# Altium project SUBBOARD-sensors.PrjPcb
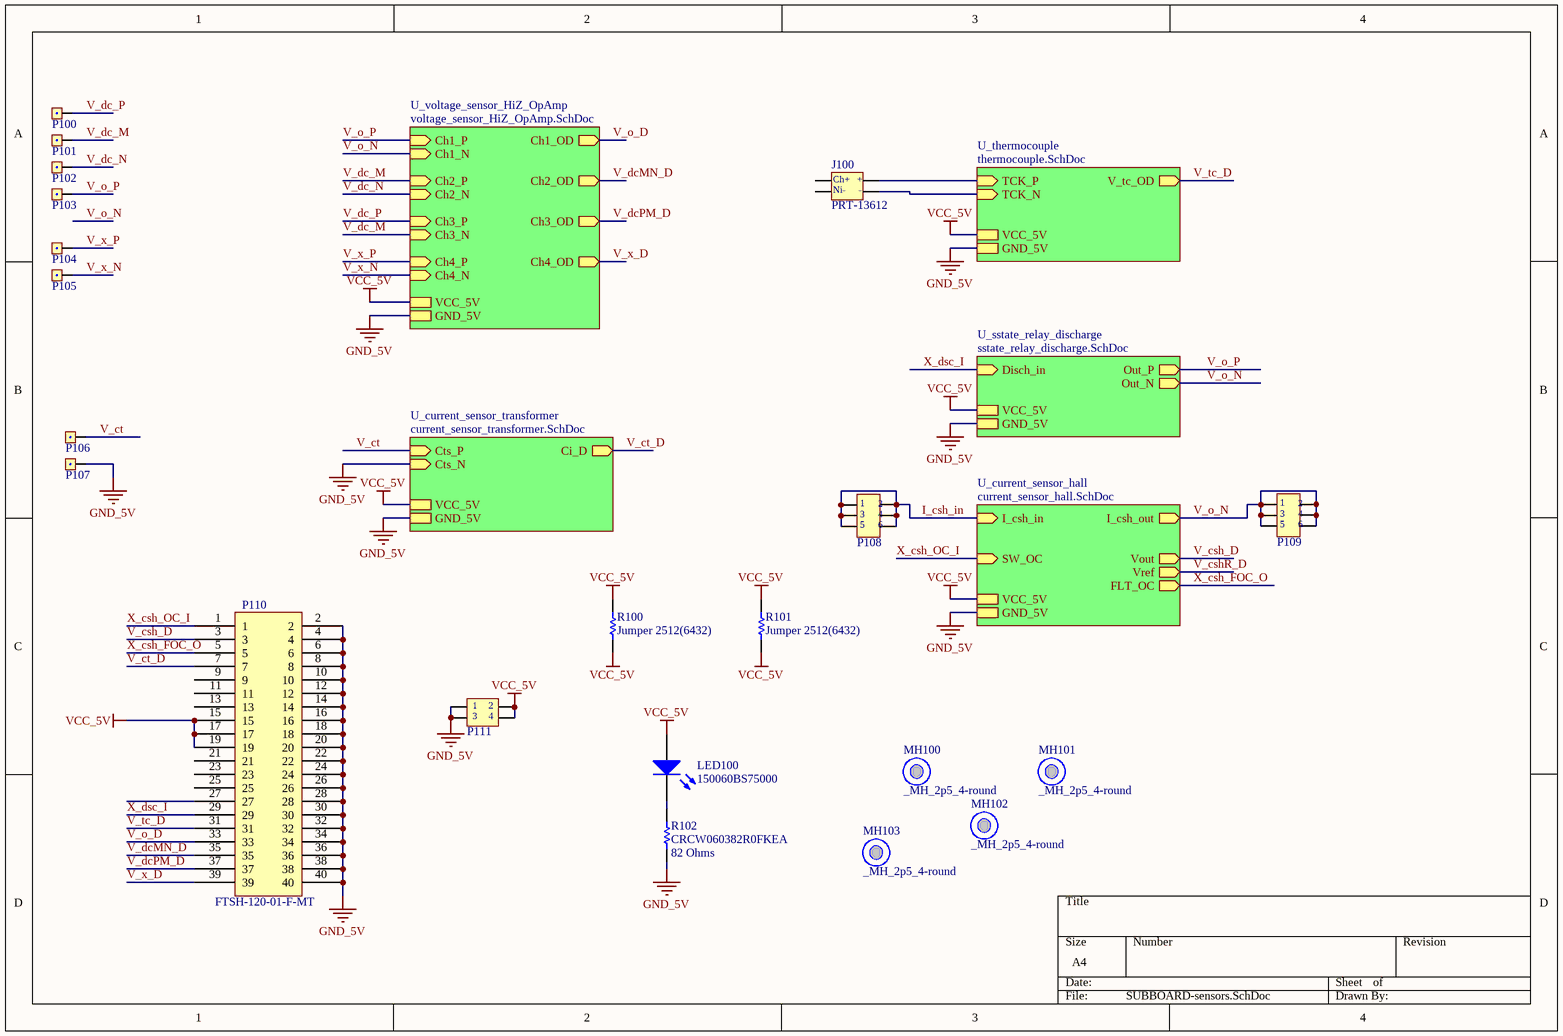
[diagram p0: SUBBOARD-sensors.SchDoc]
6 sheets, 142 parts. Net scope: hierarchical (ports join the sheet entries above them; power ports are global).
Board file: SUBBOARD-sensors.PcbDoc
Sheets:
  SUBBOARD-sensors.SchDoc
    U_voltage_sensor_HiZ_OpAmp = voltage_sensor_HiZ_OpAmp.SchDoc
    U_current_sensor_hall = current_sensor_hall.SchDoc
    U_current_sensor_transformer = current_sensor_transformer.SchDoc
    U_thermocouple = thermocouple.SchDoc
    U_sstate_relay_discharge = sstate_relay_discharge.SchDoc

## Sheet SUBBOARD-sensors.SchDoc
size A4

### Parts
J100  PRT-13612  [PRT-13612]
LED100  150060BS75000  [0603_A]
MH100  _MH_2p5_4-round  [_MH_2p5_4-round]
MH101  _MH_2p5_4-round  [_MH_2p5_4-round]
MH102  _MH_2p5_4-round  [_MH_2p5_4-round]
MH103  _MH_2p5_4-round  [_MH_2p5_4-round]
P100  TSW-101-15-G-S  [TSW-101-15-G-S]  (value not drawn)
P101  TSW-101-15-G-S  [TSW-101-15-G-S]  (value not drawn)
P102  TSW-101-15-G-S  [TSW-101-15-G-S]  (value not drawn)
P103  TSW-101-15-G-S  [TSW-101-15-G-S]  (value not drawn)
P104  TSW-101-15-G-S  [TSW-101-15-G-S]  (value not drawn)
P105  TSW-101-15-G-S  [TSW-101-15-G-S]  (value not drawn)
P106  TSW-101-15-G-S  [TSW-101-15-G-S]  (value not drawn)
P107  TSW-101-15-G-S  [TSW-101-15-G-S]  (value not drawn)
P108  TSW-103-15-G-D  [TSW-103-15-G-D]  (value not drawn)
P109  TSW-103-15-G-D  [TSW-103-15-G-D]  (value not drawn)
P110  FTSH-120-01-F-MT  [FTSH-120-01-F-MT]
P111  TMM-102-02-T-D  [TMM-102-02-T-D]  (value not drawn)
R100  Jumper 2512(6432)  [RESC2512(6432)_L]
R101  Jumper 2512(6432)  [RESC2512(6432)_L]
R102  CRCW060382R0FKEA  value 82 Ohms  [RESC1609X50X30LL10T20]

### Sub-sheets
U_current_sensor_hall = current_sensor_hall.SchDoc: I_csh_in (in), I_csh_out (out), VCC_5V, GND_5V, Vout (out), Vref (out), FLT_OC (out), SW_OC (in)
U_current_sensor_transformer = current_sensor_transformer.SchDoc: VCC_5V, GND_5V, Cts_P (in), Cts_N (in), Ci_D (out)
U_sstate_relay_discharge = sstate_relay_discharge.SchDoc: VCC_5V, GND_5V, Disch_in (in), Out_P (out), Out_N (out)
U_thermocouple = thermocouple.SchDoc: V_tc_OD (out), VCC_5V, GND_5V, TCK_P (in), TCK_N (in)
U_voltage_sensor_HiZ_OpAmp = voltage_sensor_HiZ_OpAmp.SchDoc: VCC_5V, GND_5V, Ch1_OD (out), Ch2_OD (out), Ch3_OD (out), Ch4_OD (out), Ch1_N (in), Ch1_P (in), Ch2_N (in), Ch2_P (in), Ch3_N (in), Ch3_P (in), Ch4_N (in), Ch4_P (in)

### Nets
GND_5V: P107.1 P110.2 P110.4 P110.6 P110.8 P110.10 P110.12 P110.14 P110.16 P110.18 P110.20 P110.22 P110.24 P110.26 P110.28 P110.30 P110.32 P110.34 P110.36 P110.38 P110.40 P111.1 P111.3 R102.2 ; sheet U_voltage_sensor_HiZ_OpAmp/GND_5V, sheet U_current_sensor_hall/GND_5V, sheet U_current_sensor_transformer/GND_5V, sheet U_current_sensor_transformer/Cts_N, sheet U_thermocouple/GND_5V, sheet U_sstate_relay_discharge/GND_5V
VCC_5V: LED100.2(A) P110.15 P110.17 P110.19 P111.2 P111.4 R100.1 R100.2 R101.1 R101.2 ; sheet U_voltage_sensor_HiZ_OpAmp/VCC_5V, sheet U_current_sensor_hall/VCC_5V, sheet U_current_sensor_transformer/VCC_5V, sheet U_thermocouple/VCC_5V, sheet U_sstate_relay_discharge/VCC_5V
I_csh_in: P108.1 P108.2 P108.3 P108.4 P108.5 P108.6 ; sheet U_current_sensor_hall/I_csh_in
TCK_N: J100.4 ; sheet U_thermocouple/TCK_N
TCK_P: J100.3 ; sheet U_thermocouple/TCK_P
V_csh_D: P110.3 ; sheet U_current_sensor_hall/Vout
V_ct: P106.1 ; sheet U_current_sensor_transformer/Cts_P  [project net Ct_2]
V_ct_D: P110.7 ; sheet U_current_sensor_transformer/Ci_D
V_dc_M: P101.1 ; sheet U_voltage_sensor_HiZ_OpAmp/Ch2_P, sheet U_voltage_sensor_HiZ_OpAmp/Ch3_N
V_dc_N: P102.1 ; sheet U_voltage_sensor_HiZ_OpAmp/Ch2_N
V_dc_P: P100.1 ; sheet U_voltage_sensor_HiZ_OpAmp/Ch3_P
V_dcMN_D: P110.35 ; sheet U_voltage_sensor_HiZ_OpAmp/Ch2_OD
V_dcPM_D: P110.37 ; sheet U_voltage_sensor_HiZ_OpAmp/Ch3_OD
V_o_D: P110.33 ; sheet U_voltage_sensor_HiZ_OpAmp/Ch1_OD
V_o_N: P109.1 P109.2 P109.3 P109.4 P109.5 P109.6 ; sheet U_voltage_sensor_HiZ_OpAmp/Ch1_N, sheet U_current_sensor_hall/I_csh_out, sheet U_sstate_relay_discharge/Out_N
V_o_P: P103.1 ; sheet U_voltage_sensor_HiZ_OpAmp/Ch1_P, sheet U_sstate_relay_discharge/Out_P
V_tc_D: P110.31 ; sheet U_thermocouple/V_tc_OD
V_x_D: P110.39 ; sheet U_voltage_sensor_HiZ_OpAmp/Ch4_OD
V_x_N: P105.1 ; sheet U_voltage_sensor_HiZ_OpAmp/Ch4_N
V_x_P: P104.1 ; sheet U_voltage_sensor_HiZ_OpAmp/Ch4_P
X_csh_FOC_O: P110.5 ; sheet U_current_sensor_hall/FLT_OC
X_csh_OC_I: P110.1 ; sheet U_current_sensor_hall/SW_OC
X_dsc_I: P110.29 ; sheet U_sstate_relay_discharge/Disch_in
NetLED100_1: LED100.1(K) R102.1

Not connected (* = marked no-connect by the designer): J100 1 2; P110 9 11 13 21 23 25 27

### Notes on the sheet
- (in symbol PRT-13612) Ch+; +; Ni-; -

### Library data of the parts
J100 = PRT-13612: THERMOCOUPLE CONN - PCC-SMP-K; Manufacturer: SparkFun; System: Connector; Supplier 1: Digi-Key; Manufacturer Part Number: PRT-13612; RoHS: No; Stock 1: 201; Pricing 1: 1=4.38000 (USD); ComponentLink1URL: https://cdn.sparkfun.com/datasheets/Prototyping/PCC-SMP-K-datasheet.pdf?src-supplier=Digi-Key; ComponentLink1Description: https://cdn.sparkfun.com/datasheets/Prototyping/PCC-SMP-K-datasheet.pdf?src-supplier=Digi-Key; Supplier Part Number 1: 1568-1306-ND
LED100 = CMP-1426-00003-1: SMD mono-color Chip LED, WL-SMCW, Blue; Manufacturer: Wuerth Elektronik; Color: Blue; ComponentLink2Description: Datasheet; ComponentLink2URL: http://katalog.we-online.com/led/datasheet/150060BS75000.pdf; ComponentLink1URL: http://www.we-online.com; PackageReference: 0603_A; PartNumber: 150060BS75000; ComponentLink1Description: Manufacturer URL
MH100-MH103 = _MH_2p5_4-round: matching hole 2.5 hole, 4mm pad (round)
P100-P107 = TSW-101-15-G-S: Conn Unshrouded Header HDR 1 POS Solder ST Thru-Hole; Manufacturer: Samtec; Gender: Male; Max Current Rating: 7.6A; Max Voltage Rating (AC): 550V; Number of Contacts: 1; System: Connector; Supplier 1: Digi-Key; Manufacturer Part Number: TSW-101-15-G-S; RoHS: Yes; Category: Connectors; Stock 1: 1116; Pricing 1: 1=0.16000 (USD); Mount: Through Hole; Housing Material: Polyester; Housing Color: Black; Contact Material: Bronze; Contact Plating: Gold; Min Operating Temperature: -55°C; Max Operating Temperature: 125°C; Orientation: Straight; Number of Rows: 1; Packaging: Bulk; Termination: Solder; Length: 2.54mm; Depth: 2.54mm; Radiation Hardening: No; REACH SVHC: No SVHC; ComponentLink1URL: https://datasheet.ciiva.com/16736/htsw-th-16736491.pdf?src-supplier=Avnet+Europe; ComponentLink1Description: https://datasheet.ciiva.com/16736/htsw-th-16736491.pdf?src-supplier=Avnet+Europe; ComponentLink2URL: https://datasheet.ciiva.com/10337/htsw-th-10337087.pdf?src-supplier=Avnet; ComponentLink2Description: https://datasheet.ciiva.com/10337/htsw-th-10337087.pdf?src-supplier=Avnet; Supplier Part Number 1: TSW-101-15-G-S-ND
P108 P109 = TSW-103-15-G-D: .025" SQ. TERMINAL STRIPS; Manufacturer: Samtec; Number of Contacts: 6; Gender: Male; Max Voltage Rating (AC): 550V; Max Current Rating: 7.6A; Pitch: 2.54mm; System: Connector; Supplier 1: Digi-Key; Manufacturer Part Number: TSW-103-15-G-D; RoHS: Yes; Category: Headers and Wire Housings; Stock 1: 480; Pricing 1: 1=0.78000, 10=0.73200, 100=0.56120, 500=0.48800, 1000=0.40260, 5000=0.35380, 10000=0.32940 (USD); Contact Plating: Gold; Contact Material: Bronze; Housing Material: Polyester; Housing Color: Black; Min Operating Temperature: -55°C; Max Operating Temperature: 125°C; Termination: Solder; Number of Rows: 2; Packaging: Bulk; Orientation: Straight; Length: 7.62mm; Row Spacing: 2.54mm; Depth: 5.08mm; Radiation Hardening: No; REACH SVHC: No SVHC; ComponentLink1URL: https://datasheet.ciiva.com/16723/htsw-th-16723063.pdf?src-supplier=Avnet+Europe; ComponentLink1Description: https://datasheet.ciiva.com/16723/htsw-th-16723063.pdf?src-supplier=Avnet+Europe; ComponentLink2URL: https://datasheet.ciiva.com/29947/htsw-th-29947802.pdf?src-supplier=Avnet; ComponentLink2Description: https://datasheet.ciiva.com/29947/htsw-th-29947802.pdf?src-supplier=Avnet; Supplier Part Number 1: SAM12306-ND
P110 = FTSH-120-01-F-MT: Conn Unshrouded Header HDR 40 POS 1.27mm Solder RA Thru-Hole/SMD Tube; Manufacturer: Samtec; Number of Contacts: 40; Gender: Male; System: Connector; Supplier 1: Digi-Key; Manufacturer Part Number: FTSH-120-01-F-MT; RoHS: Yes; Category: Headers and Wire Housings; Stock 1: 47; Pricing 1: 1=5.48000 (USD); Contact Plating: Gold; Contact Material: Bronze; Housing Material: Polymer; Housing Color: Black; Min Operating Temperature: -55°C; Max Operating Temperature: 125°C; Number of Rows: 2; Termination: Solder; Packaging: Rail/Tube; Orientation: Right Angle; Length: 25.4mm; Pitch: 1.27mm; Depth: 10.64mm; Radiation Hardening: No; Lead Free: Lead Free; ComponentLink1URL: https://datasheet.ciiva.com/16697/ftsh-mt-16697612.pdf?src-supplier=Avnet+Europe; ComponentLink1Description: https://datasheet.ciiva.com/16697/ftsh-mt-16697612.pdf?src-supplier=Avnet+Europe; Supplier Part Number 1: FTSH-120-01-F-MT-ND; Supplier 2: Avnet; Pricing 2: 1=5.23577, 10=4.92660, 30=4.79780, 50=4.57240, 100=4.37920 (USD); Supplier 3: Newark; Pricing 3: 1=5.48000, 10=5.04000, 25=4.62000, 50=4.43000, 100=4.21000, 250=3.68000, 500=3.57000 (USD); Supplier Part Number 2: FTSH-120-01-F-MT; Supplier Part Number 3: 01R7043
P111 = TMM-102-02-T-D: SAMTEC         TMM-102-02-T-D             Board-To-Board Connector, TMM Series, 4 Contacts, Header, 2 mm, Through Hole, 2 Rows; Gender: Male; Number of Contacts: 4; Pitch: 2mm; Supplier 1: Digi-Key; Manufacturer: Samtec; Manufacturer Part Number: TMM-102-02-T-D; RoHS: Yes; Category: Connectors; Stock 1: 996; Pricing 1: 1=0.36000 (USD); Mount: Through Hole; Contact Plating: Tin; Contact Material: Bronze; Packaging: Bulk; Number of Rows: 2; Termination: Solder; Radiation Hardening: No; Lead Free: Lead Free; REACH SVHC: No SVHC; ComponentLink1URL: http://www.farnell.com/datasheets/2047777.pdf?src-supplier=Farnell; ComponentLink1Description: http://www.farnell.com/datasheets/2047777.pdf?src-supplier=Farnell; ComponentLink2URL: ftp://ftp.samtec.com/webfiles/PDF/TMM_TH.PDF?src-supplier=Avnet; ComponentLink2Description: ftp://ftp.samtec.com/webfiles/PDF/TMM_TH.PDF?src-supplier=Avnet; Supplier Part Number 1: TMM-102-02-T-D-ND; System: Connector
R100 R101 = CMP-1018-00001-1: Jumper 2512 (6432 Metric); Tolerance: None; Case-EIA: 2512; Value: 0.00 Ohm; Case-Metric: 6432; Technology: SMT; Power: None
R102 = CMP-2000-03606-1: Manufacturer: Vishay Dale; Part Number: CRCW060382R0FKEA

## Sheet voltage_sensor_HiZ_OpAmp.SchDoc
size A3
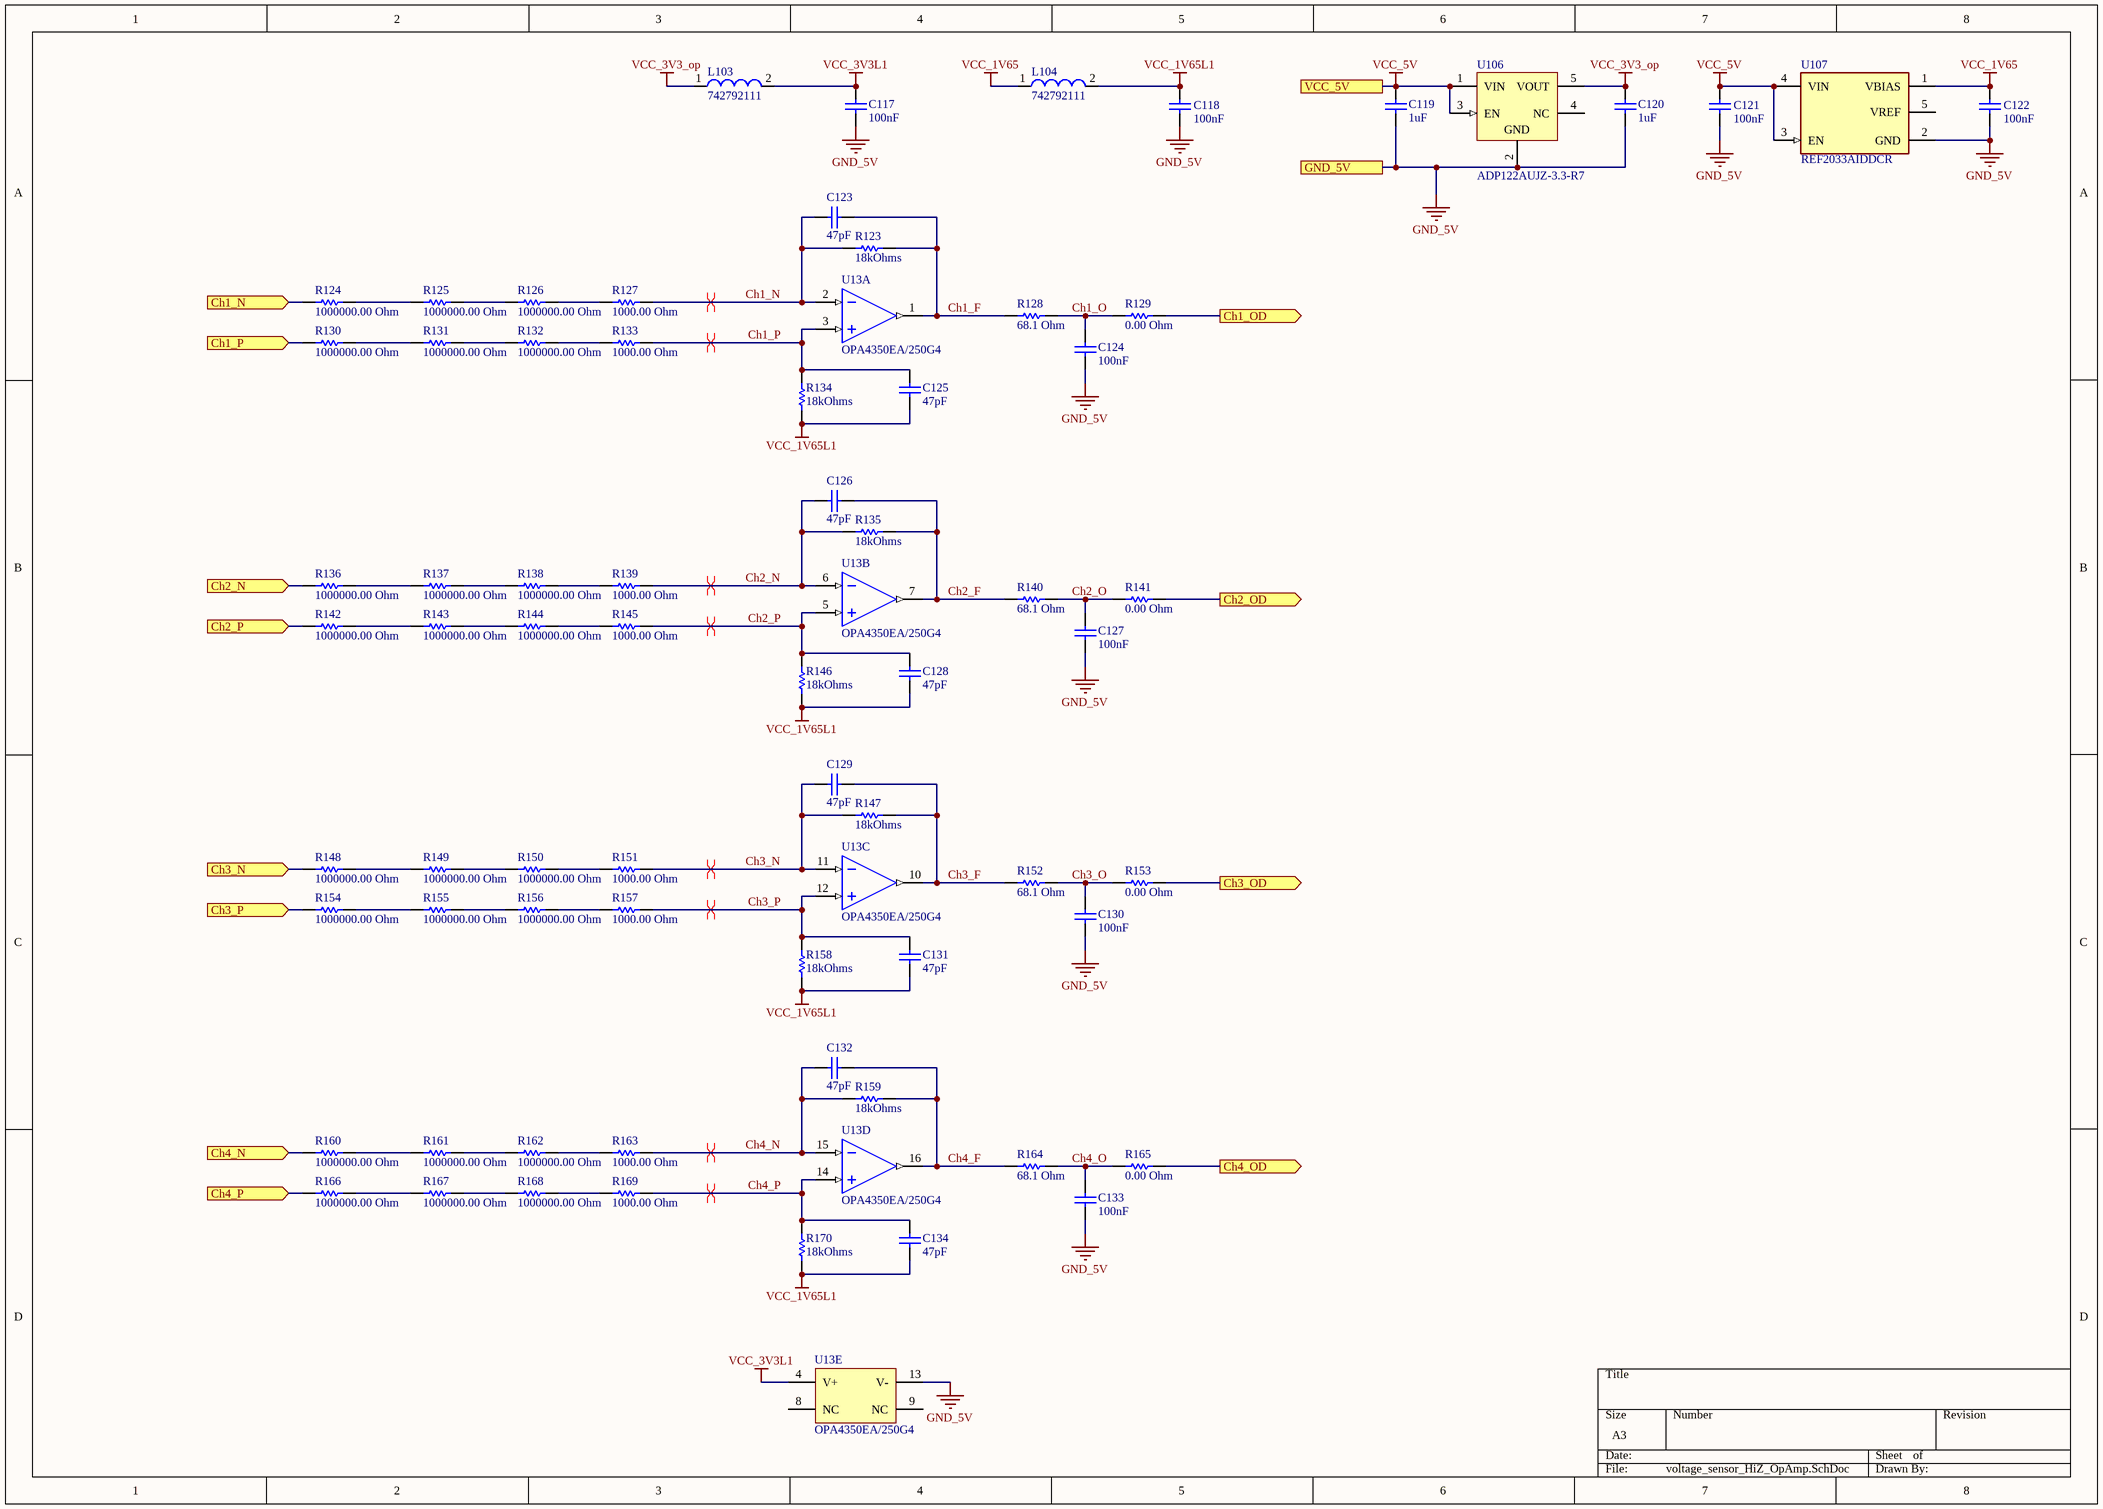
[diagram p1: voltage_sensor_HiZ_OpAmp.SchDoc]

### Parts
C117  value 100nF  [CAPC0603(1608)100_N]  (hidden comment: CAP 100nF 10V 0603(1608))
C118  value 100nF  [CAPC0603(1608)100_N]  (hidden comment: CAP 100nF 10V 0603(1608))
C119  value 1uF  [CAPC0603(1608)100_N]  (hidden comment: CAP 1uF 50V 0603(1608))
C120  value 1uF  [CAPC0603(1608)100_N]  (hidden comment: CAP 1uF 50V 0603(1608))
C121  value 100nF  [CAPC0603(1608)100_N]  (hidden comment: CAP 100nF 10V 0603(1608))
C122  value 100nF  [CAPC0603(1608)100_N]  (hidden comment: CAP 100nF 10V 0603(1608))
C123  value 47pF  [CAPC0603(1608)100_L]  (hidden comment: CAP 47pF 50V 0603(1608))
C124  value 100nF  [CAPC0603(1608)100_L]  (hidden comment: CAP 100nF 10V 0603(1608))
C125  value 47pF  [CAPC0603(1608)100_L]  (hidden comment: CAP 47pF 50V 0603(1608))
C126  value 47pF  [CAPC0603(1608)100_L]  (hidden comment: CAP 47pF 50V 0603(1608))
C127  value 100nF  [CAPC0603(1608)100_L]  (hidden comment: CAP 100nF 10V 0603(1608))
C128  value 47pF  [CAPC0603(1608)100_L]  (hidden comment: CAP 47pF 50V 0603(1608))
C129  value 47pF  [CAPC0603(1608)100_L]  (hidden comment: CAP 47pF 50V 0603(1608))
C130  value 100nF  [CAPC0603(1608)100_L]  (hidden comment: CAP 100nF 10V 0603(1608))
C131  value 47pF  [CAPC0603(1608)100_L]  (hidden comment: CAP 47pF 50V 0603(1608))
C132  value 47pF  [CAPC0603(1608)100_L]  (hidden comment: CAP 47pF 50V 0603(1608))
C133  value 100nF  [CAPC0603(1608)100_L]  (hidden comment: CAP 100nF 10V 0603(1608))
C134  value 47pF  [CAPC0603(1608)100_L]  (hidden comment: CAP 47pF 50V 0603(1608))
L103  742792111  [SMD-1206]
L104  742792111  [SMD-1206]
R123  Resistance: 18kOhms  [RESC1608X55X25NL10T15]  (hidden comment: RC0603FR-0718KL)
R124  value 1000000.00 Ohm  [RESC1206(3216)_L]  (hidden comment: 1M 1% 1206(3216))
R125  value 1000000.00 Ohm  [RESC1206(3216)_L]  (hidden comment: 1M 1% 1206(3216))
R126  value 1000000.00 Ohm  [RESC1206(3216)_L]  (hidden comment: 1M 1% 1206(3216))
R127  value 1000.00 Ohm  [RESC1206(3216)_L]  (hidden comment: 1K 1% 1206(3216))
R128  value 68.1 Ohm  [RESC1608X55X30LL15T15]  (hidden comment: ERJ-3EKF68R1V)
R129  value 0.00 Ohm  [RESC0603(1608)_L]  (hidden comment: Jumper 0603(1608))
R130  value 1000000.00 Ohm  [RESC1206(3216)_L]  (hidden comment: 1M 1% 1206(3216))
R131  value 1000000.00 Ohm  [RESC1206(3216)_L]  (hidden comment: 1M 1% 1206(3216))
R132  value 1000000.00 Ohm  [RESC1206(3216)_L]  (hidden comment: 1M 1% 1206(3216))
R133  value 1000.00 Ohm  [RESC1206(3216)_L]  (hidden comment: 1K 1% 1206(3216))
R134  Resistance: 18kOhms  [RESC1608X55X25NL10T15]  (hidden comment: RC0603FR-0718KL)
R135  Resistance: 18kOhms  [RESC1608X55X25NL10T15]  (hidden comment: RC0603FR-0718KL)
R136  value 1000000.00 Ohm  [RESC1206(3216)_L]  (hidden comment: 1M 1% 1206(3216))
R137  value 1000000.00 Ohm  [RESC1206(3216)_L]  (hidden comment: 1M 1% 1206(3216))
R138  value 1000000.00 Ohm  [RESC1206(3216)_L]  (hidden comment: 1M 1% 1206(3216))
R139  value 1000.00 Ohm  [RESC1206(3216)_L]  (hidden comment: 1K 1% 1206(3216))
R140  value 68.1 Ohm  [RESC1608X55X30LL15T15]  (hidden comment: ERJ-3EKF68R1V)
R141  value 0.00 Ohm  [RESC0603(1608)_L]  (hidden comment: Jumper 0603(1608))
R142  value 1000000.00 Ohm  [RESC1206(3216)_L]  (hidden comment: 1M 1% 1206(3216))
R143  value 1000000.00 Ohm  [RESC1206(3216)_L]  (hidden comment: 1M 1% 1206(3216))
R144  value 1000000.00 Ohm  [RESC1206(3216)_L]  (hidden comment: 1M 1% 1206(3216))
R145  value 1000.00 Ohm  [RESC1206(3216)_L]  (hidden comment: 1K 1% 1206(3216))
R146  Resistance: 18kOhms  [RESC1608X55X25NL10T15]  (hidden comment: RC0603FR-0718KL)
R147  Resistance: 18kOhms  [RESC1608X55X25NL10T15]  (hidden comment: RC0603FR-0718KL)
R148  value 1000000.00 Ohm  [RESC1206(3216)_L]  (hidden comment: 1M 1% 1206(3216))
R149  value 1000000.00 Ohm  [RESC1206(3216)_L]  (hidden comment: 1M 1% 1206(3216))
R150  value 1000000.00 Ohm  [RESC1206(3216)_L]  (hidden comment: 1M 1% 1206(3216))
R151  value 1000.00 Ohm  [RESC1206(3216)_L]  (hidden comment: 1K 1% 1206(3216))
R152  value 68.1 Ohm  [RESC1608X55X30LL15T15]  (hidden comment: ERJ-3EKF68R1V)
R153  value 0.00 Ohm  [RESC0603(1608)_L]  (hidden comment: Jumper 0603(1608))
R154  value 1000000.00 Ohm  [RESC1206(3216)_L]  (hidden comment: 1M 1% 1206(3216))
R155  value 1000000.00 Ohm  [RESC1206(3216)_L]  (hidden comment: 1M 1% 1206(3216))
R156  value 1000000.00 Ohm  [RESC1206(3216)_L]  (hidden comment: 1M 1% 1206(3216))
R157  value 1000.00 Ohm  [RESC1206(3216)_L]  (hidden comment: 1K 1% 1206(3216))
R158  Resistance: 18kOhms  [RESC1608X55X25NL10T15]  (hidden comment: RC0603FR-0718KL)
R159  Resistance: 18kOhms  [RESC1608X55X25NL10T15]  (hidden comment: RC0603FR-0718KL)
R160  value 1000000.00 Ohm  [RESC1206(3216)_L]  (hidden comment: 1M 1% 1206(3216))
R161  value 1000000.00 Ohm  [RESC1206(3216)_L]  (hidden comment: 1M 1% 1206(3216))
R162  value 1000000.00 Ohm  [RESC1206(3216)_L]  (hidden comment: 1M 1% 1206(3216))
R163  value 1000.00 Ohm  [RESC1206(3216)_L]  (hidden comment: 1K 1% 1206(3216))
R164  value 68.1 Ohm  [RESC1608X55X30LL15T15]  (hidden comment: ERJ-3EKF68R1V)
R165  value 0.00 Ohm  [RESC0603(1608)_L]  (hidden comment: Jumper 0603(1608))
R166  value 1000000.00 Ohm  [RESC1206(3216)_L]  (hidden comment: 1M 1% 1206(3216))
R167  value 1000000.00 Ohm  [RESC1206(3216)_L]  (hidden comment: 1M 1% 1206(3216))
R168  value 1000000.00 Ohm  [RESC1206(3216)_L]  (hidden comment: 1M 1% 1206(3216))
R169  value 1000.00 Ohm  [RESC1206(3216)_L]  (hidden comment: 1K 1% 1206(3216))
R170  Resistance: 18kOhms  [RESC1608X55X25NL10T15]  (hidden comment: RC0603FR-0718KL)
U13  OPA4350EA/250G4  [TI-DBQ16_L]  (parts A,B,C,D,E of 5)
U106  ADP122AUJZ-3.3-R7  [ADI-UJ-5_N]
U107  REF2033AIDDCR  [FP-DDC0005A-IPC_C]

### Ports
Ch1_N (in), Ch1_OD (out), Ch1_P (in), Ch2_N (in), Ch2_OD (out), Ch2_P (in), Ch3_N (in), Ch3_OD (out), Ch3_P (in), Ch4_N (in), Ch4_OD (out), Ch4_P (in), GND_5V, VCC_5V

### Nets
GND_5V: C117.1 C118.1 C119.1 C120.1 C121.1 C122.1 C124.1 C127.1 C130.1 C133.1 U13.13(V-) U106.2(GND) U107.2(GND) ; port GND_5V
VCC_1V65: C122.2 L104.1 U107.1(VBIAS)
VCC_1V65L1: C118.2 C125.2 C128.2 C131.2 C134.2 L104.2 R134.2 R146.2 R158.2 R170.2
VCC_3V3_op: C120.2 L103.1 U106.5(VOUT)
VCC_3V3L1: C117.2 L103.2 U13.4(V+)
VCC_5V: C119.2 C121.2 U106.1(VIN) U106.3(EN) U107.3(EN) U107.4(VIN) ; port VCC_5V
Ch1_F: C123.2 R123.1 R128.2 U13.1(OUT_A)
Ch1_N: C123.1 R123.2 R127.1 U13.2(IN_A-)
Ch1_O: C124.2 R128.1 R129.2
Ch1_P: C125.1 R133.1 R134.1 U13.3(IN_A+)
Ch2_F: C126.2 R135.1 R140.2 U13.7(OUT_B)
Ch2_N: C126.1 R135.2 R139.1 U13.6(IN_B-)
Ch2_O: C127.2 R140.1 R141.2
Ch2_P: C128.1 R145.1 R146.1 U13.5(IN_B+)
Ch3_F: C129.2 R147.1 R152.2 U13.10(OUT_C)
Ch3_N: C129.1 R147.2 R151.1 U13.11(IN_C-)
Ch3_O: C130.2 R152.1 R153.2
Ch3_P: C131.1 R157.1 R158.1 U13.12(IN_C+)
Ch4_F: C132.2 R159.1 R164.2 U13.16(OUT_D)
Ch4_N: C132.1 R159.2 R163.1 U13.15(IN_D-)
Ch4_O: C133.2 R164.1 R165.2
Ch4_P: C134.1 R169.1 R170.1 U13.14(IN_D+)
V_dc_M: R142.2 R148.2 ; port Ch2_P, port Ch3_N
V_dc_N: R136.2 ; port Ch2_N
V_dc_P: R154.2 ; port Ch3_P
V_dcMN_D: R141.1 ; port Ch2_OD
V_dcPM_D: R153.1 ; port Ch3_OD
V_o_D: R129.1 ; port Ch1_OD
V_o_N: R124.2 ; port Ch1_N
V_o_P: R130.2 ; port Ch1_P
V_x_D: R165.1 ; port Ch4_OD
V_x_N: R160.2 ; port Ch4_N
V_x_P: R166.2 ; port Ch4_P
NetR124_1: R124.1 R125.2
NetR125_1: R125.1 R126.2
NetR126_1: R126.1 R127.2
NetR130_1: R130.1 R131.2
NetR131_1: R131.1 R132.2
NetR132_1: R132.1 R133.2
NetR136_1: R136.1 R137.2
NetR137_1: R137.1 R138.2
NetR138_1: R138.1 R139.2
NetR142_1: R142.1 R143.2
NetR143_1: R143.1 R144.2
NetR144_1: R144.1 R145.2
NetR148_1: R148.1 R149.2
NetR149_1: R149.1 R150.2
NetR150_1: R150.1 R151.2
NetR154_1: R154.1 R155.2
NetR155_1: R155.1 R156.2
NetR156_1: R156.1 R157.2
NetR160_1: R160.1 R161.2
NetR161_1: R161.1 R162.2
NetR162_1: R162.1 R163.2
NetR166_1: R166.1 R167.2
NetR167_1: R167.1 R168.2
NetR168_1: R168.1 R169.2

Not connected (* = marked no-connect by the designer): U13 8(NC) 9(NC); U106 4(NC); U107 5(VREF)

### Layout directives
differential pair: Ch1_N, Ch1_P, Ch2_N, Ch2_P, Ch3_N, Ch3_P, Ch4_N, Ch4_P

### Library data of the parts
C117 C118 C121 C122 C124 C127 C130 C133 = CMP-1035-02580-1: CAP 100nF 10V ±10% 0603 (1608 Metric) Thickness 1mm SMD; Tolerance: Â±10%; Case-EIA: 0603; Case-Metric: 1608; Max Thickness: 1 mm; Rated Voltage: 10 V; Technology: SMT
C119 C120 = CMP-1035-02746-1: CAP 1uF 50V ±20% 0603 (1608 Metric) Thickness 1mm SMD; Tolerance: Â±20%; Case-EIA: 0603; Case-Metric: 1608; Technology: SMT; Max Thickness: 1 mm; Rated Voltage: 50 V
C123 C125 C126 C128 C129 C131 C132 C134 = CMP-1035-01063-1: CAP 47pF 50V ±5% 0603 (1608 Metric) Thickness 1mm SMD; Case-EIA: 0603; Tolerance: Â±5%; Case-Metric: 1608; Technology: SMT; Max Thickness: 1 mm; Rated Voltage: 50 V
L103 L104 = CMP-0220-00024-1: SMD EMI Suppression Ferrite Bead WE-CBF, Z = 26 Ohm; Impedance: 26 Ohm; ComponentLink2Description: Datasheet; PackageReference: SMD-1206; ComponentLink2URL: http://www.we-online.de/katalog/media/pdf/742792111.pdf; PackageVersion: 2007; DatasheetVersion: Dec-2005; PackageDescription: Chip Inductor, 2-Leads, Body 3.2 x 1.6 mm; ComponentLink1URL: http://www.we-online.com; ComponentLink1Description: Manufacturer Link
R123 R134 R135 R146 R147 R158 R159 R170 = CMP-2000-06930-1: Chip Resistor, 18 KOhm, +/- 1%, 0.1 W, -55 to 155 degC, 0603 (1608 Metric), RoHS, Tape and Reel; Manufacturer: Yageo; Voltage Rating: 75V; Temperature Coefficient: 100PPM/C; Unit Weight: 0.000071oz; Power Rating: 100mW; Datasheet URL: http://www.yageo.com/documents/recent/PYu-RC_Group_51_RoHS_L_7.pdf; Packaging: Reel; Series: RC; Datasheet Version: Rev. 7, 05/2017; Type: GeneralPurposeChipResistorSurfaceMount; Termination Style: SMD/SMT; Package Reference: 0603; Operating Temperature Range: -55Cto+155C; Mounting Technology: SurfaceMount; Tolerance: 1%; Height: 0.45mm; Length: 1.6mm; Case Code - mm: 1608; Product: ThickFilmResistorsGeneralPurpose; RoHS: True; Product Category: ThickFilmResistors; Case Code - in: 0603; Brand: Yageo; Manufacturer URL: http://www.yageo.com/; Width: 0.8mm; Package / Case: 0603(1608metric); Package Description: 2-Pin Surface Mount Device, Body 1.6 x 0.8 mm
R124-R126 R130-R132 R136-R138 R142-R144 R148-R150 R154-R156 R160-R162 R166-R168 = CMP-1014-00849-1: 1M 0.25W 1% 1206 (3216 Metric)  SMD; Case-EIA: 1206; Case-Metric: 3216; Tolerance: 1 %; Power: 0.25 W; Technology: SMT
R127 R133 R139 R145 R151 R157 R163 R169 = CMP-1014-00510-1: 1K 0.25W 1% 1206 (3216 Metric)  SMD; Case-Metric: 3216; Case-EIA: 1206; Power: 0.25 W; Tolerance: 1 %; Technology: SMT
R128 R140 R152 R164 = CMP-2000-00621-1: Manufacturer: Panasonic; Tolerance: 1%; Part Number: ERJ-3EKF68R1V; Package: 0603
R129 R141 R153 R165 = CMP-1012-00001-1: Jumper 0603 (1608 Metric); Case-Metric: 1608; Power: None; Case-EIA: 0603; Technology: SMT; Tolerance: None
U13 = CMP-0272-00834-2: High-Speed, Single-Supply, Rail-to-Rail Operational Amplifier MicroAmplifier(TM) Series, 2.7 to 5.5 V, -55 to 150 degC, 16-pin SOP (DBQ16), Green (RoHS & no Sb/Br); Manufacturer: Texas Instruments; Iq per channel(Max)(mA): 7.5; Slew Rate(Typ)(V/us): 22; Sub Family: Low Input Bias Current Amp (<=10pA), Low Offset Voltage Amplifier (<=500uV), Low Supply Voltage Amplifier (<=2.7V), Precision Amplifier; Vn at 1kHz(Typ)(nV/rtHz): 18; CMRR(Min)(dB): 66; Offset Drift(Typ)(uV/C): 4; Vio (25C)(Max)(mV): 0.5; Total Supply Voltage(Min)(+5V is 5, +/-5V is 10): 2.7; IIB(Max)(pA): 10; Total Supply Voltage(Max)(+5V is 5, +/-5V is 10): 5.5; Eco-Plan: Green (RoHS & no Sb/Br); PackageVersion: 4073301-2/H, 10/2008; ComponentLink1Description: Manufacturer URL; ComponentLink2Description: Datasheet; Mounting Technology: Surface Mount; ComponentLink3Description: Package Specification; PackageReference: DBQ16; PartNumber: OPA4350EA/250G4; ComponentLink2URL: http://www.ti.com/general/docs/lit/getliterature.tsp?genericPartNumber=OPA4350&fileType=pdf; ComponentLink1URL: http://www.ti.com/; Code_JEDEC: MO-137; DatasheetVersion: SBOS099C; Number of Channels: 4; ComponentLink3URL: http://www.ti.com/litv/pdf/msoi004g; PackageDescription: 16-Pin, Plastic Small Outline, Body 3.9 x 4.9 mm, Pitch 0.635 mm
U106 = CMP-0786-00346-1: 300 mA, Low Quiescent Current, CMOS Linear Regulator, 2.3 to 5.5 V Vin, 3.3 V Vout, Industrial, 5-pin SOT23 (UJ-5), Reel; Manufacturer: Analog Devices; Vin (min) (V): 2.3; Supply Current IGND @ Small Load: 45uA; Vin (max) (V): 5.5; Iout max: 300mA; Preset Vout Values (V): 3.3; ComponentLink4Description: URL Link1; ComponentLink4URL: Product URL:http://www.analog.com/en/ADP122/productSearch.html; ComponentLink2URL: http://www.analog.com/static/imported-files/data_sheets/ADP122_123.pdf; PackageDescription: 5-Pin Thin Small Outline Transistor Package, Body 2.9 x 1.6 mm, Pitch 0.95 mm; ComponentLink1URL: http://www.analog.com/en/index.html; ComponentLink3URL: http:/www.analog.com/static/imported-files/packages/PKG_PDF/TSOT(UJ)/UJ_5.pdf; ComponentLink2Description: Datasheet; PartNumber: ADP122AUJZ-3.3-R7; Packing: Reel; ComponentLink1Description: Manufacturer URL; Code_JEDEC: MO-193-AB; PackageVersion: 100708-A, 10/2008; PackageReference: UJ-5; Mounting Technology: Surface Mount; DatasheetVersion: Rev. E; ComponentLink3Description: Package Specification
U107 = CMP-04916-000008-1: IC VREF SERIES 1.65V/3.3V 5SOT; Manufacturer: Texas Instruments; Standoff Height: 0mm; Nominal Supply Current: 360uA; Min Supply Voltage: 3.32V; Output Type: Fixed; Number Of Outputs: 2; Output Voltage: 1.65/3.3V; Output Current: 20mA; Max Supply Voltage: 5.5V; Max Junction Temp: +150°C; Automotive: No; Height: 1.1mm; Package: DDC0005A; Reference Type: Series; Manufacturer Part Number: REF2033AIDDCR; Temperature Range High: +125°C; Lead Free: Yes; ComponentLink2Description: Datasheet; Device Class L1: Integrated Circuits (ICs); Category: IC; RoHS: TRUE; Device Class L3: Voltage References; ComponentLink2URL: http://www.ti.com/lit/ds/symlink/ref2033.pdf; Device Class L2: Power Management ICs; Octopart: https://octopart.com/ref2033aiddcr-texas+instruments-46921199; Digikey Description: IC VREF SERIES 1.65V/3.3V 5SOT; Temperature: -40°C to +125°C; Temperature Range Low: -40°C

## Sheet current_sensor_hall.SchDoc
size A4
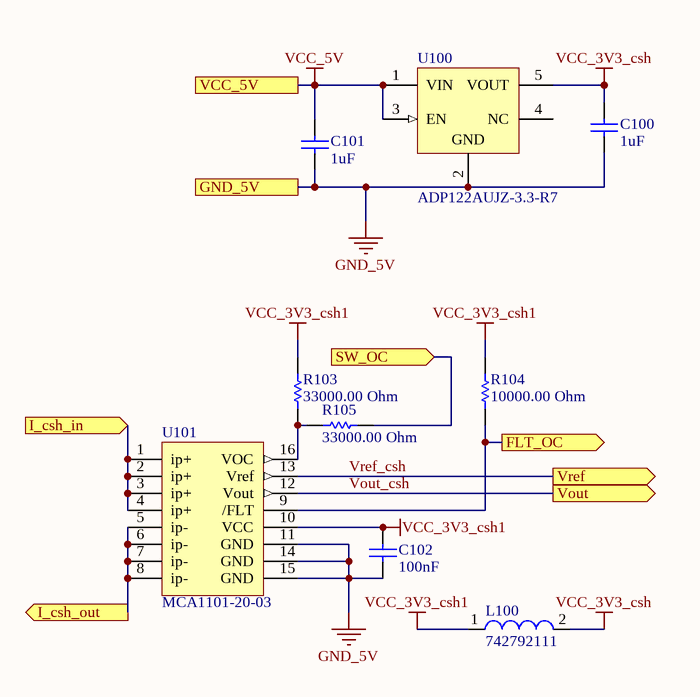
[diagram p2: current_sensor_hall.SchDoc]

### Parts
C100  value 1uF  [CAPC0603(1608)100_N]  (hidden comment: CAP 1uF 50V 0603(1608))
C101  value 1uF  [CAPC0603(1608)100_N]  (hidden comment: CAP 1uF 50V 0603(1608))
C102  value 100nF  [CAPC0603(1608)100_L]  (hidden comment: CAP 100nF 10V 0603(1608))
L100  742792111  [SMD-1206]
R103  value 33000.00 Ohm  [RESC0805(2012)_L]  (hidden comment: 33K 5% 0805(2012))
R104  value 10000.00 Ohm  [RESC0603(1608)_L]  (hidden comment: 10K 5% 0603(1608))
R105  value 33000.00 Ohm  [RESC0805(2012)_L]  (hidden comment: 33K 5% 0805(2012))
U100  ADP122AUJZ-3.3-R7  [ADI-UJ-5_L]
U101  MCA1101-20-03  [SOIC127P1030X265-16N]

### Ports
FLT_OC (out), GND_5V, I_csh_in (in), I_csh_out (out), SW_OC (in), VCC_5V, Vout (out), Vref (out)

### Nets
GND_5V: C100.1 C101.1 C102.1 U100.2(GND) U101.11(GND) U101.14(GND) U101.15(GND) ; port GND_5V
VCC_3V3_csh: C100.2 L100.2 U100.5(VOUT)
VCC_3V3_csh1: C102.2 L100.1 R103.2 R104.1 U101.10(VCC)
VCC_5V: C101.2 U100.1(VIN) U100.3(EN) ; port VCC_5V
I_csh_in: U101.1(ip+) U101.2(ip+) U101.3(ip+) U101.4(ip+) ; port I_csh_in
V_o_N: U101.5(ip-) U101.6(ip-) U101.7(ip-) U101.8(ip-) ; port I_csh_out
Vout_csh: U101.12(Vout) ; port Vout  [project net V_csh_D]
Vref_csh: U101.13(Vref) ; port Vref  [project net V_cshR_D]
X_csh_FOC_O: R104.2 U101.9(/FLT) ; port FLT_OC
X_csh_OC_I: R105.1 ; port SW_OC
NetR103_1: R103.1 R105.2 U101.16(VOC)

Not connected (* = marked no-connect by the designer): U100 4(NC)

### Library data of the parts
C100 C101 = CMP-1035-02746-1: as C119 on sheet voltage_sensor_HiZ_OpAmp; Technology: SMT; Max Thickness: 1 mm; Rated Voltage: 50 V
C102 = CMP-1035-02580-1: as C117 on sheet voltage_sensor_HiZ_OpAmp; Max Thickness: 1 mm; Rated Voltage: 10 V; Technology: SMT
L100 = CMP-0220-00024-1: as L103 on sheet voltage_sensor_HiZ_OpAmp; ComponentLink2Description: Datasheet; PackageReference: SMD-1206; ComponentLink2URL: http://www.we-online.de/katalog/media/pdf/742792111.pdf; PackageVersion: 2007; DatasheetVersion: Dec-2005; PackageDescription: Chip Inductor, 2-Leads, Body 3.2 x 1.6 mm; ComponentLink1URL: http://www.we-online.com; ComponentLink1Description: Manufacturer Link
R103 R105 = CMP-1013-00110-1: 33K 0.125W 5% 0805 (2012 Metric)  SMD; Case-EIA: 0805; Case-Metric: 2012; Power: 0.125 W; Tolerance: 5 %; Technology: SMT
R104 = CMP-1012-00098-1: 10K 0.1W 5% 0603 (1608 Metric)  SMD; Case-EIA: 0603; Case-Metric: 1608; Technology: SMT; Tolerance: 5 %; Power: 0.1 W
U100 = CMP-0786-00346-1: as U106 on sheet voltage_sensor_HiZ_OpAmp; ComponentLink4Description: URL Link1; ComponentLink4URL: Product URL:http://www.analog.com/en/ADP122/productSearch.html; ComponentLink2URL: http://www.analog.com/static/imported-files/data_sheets/ADP122_123.pdf; PackageDescription: 5-Pin Thin Small Outline Transistor Package, Body 2.9 x 1.6 mm, Pitch 0.95 mm; ComponentLink1URL: http://www.analog.com/en/index.html; ComponentLink3URL: http:/www.analog.com/static/imported-files/packages/PKG_PDF/TSOT(UJ)/UJ_5.pdf; ComponentLink2Description: Datasheet; PartNumber: ADP122AUJZ-3.3-R7; Packing: Reel; ComponentLink1Description: Manufacturer URL; Code_JEDEC: MO-193-AB; PackageVersion: 100708-A, 10/2008; PackageReference: UJ-5; Mounting Technology: Surface Mount; DatasheetVersion: Rev. E; ComponentLink3Description: Package Specification
U101 = MCA1101-20-03: High Accuracy Current Sensor IC with 1.5MHz 3dB Bandwidth and Isolation ±20A,, 3.3V, Ratiometric; Manufacturer: ACEINNA; Mouser Part Number: 438-MCA1101-20-3; Mouser Price/Stock: https://www.mouser.com/Search/Refine.aspx?Keyword=438-MCA1101-20-3; Datasheet Link: https://www.mouser.cl/datasheet/2/940/6020-1104-01_B_Datasheet_2c_Current_Sensor_Fix_Gai-1622847.pdf; Current rating: 20A; Supply voltage: 3.3V; Package/Case: SOIC 16

## Sheet current_sensor_transformer.SchDoc
size A4
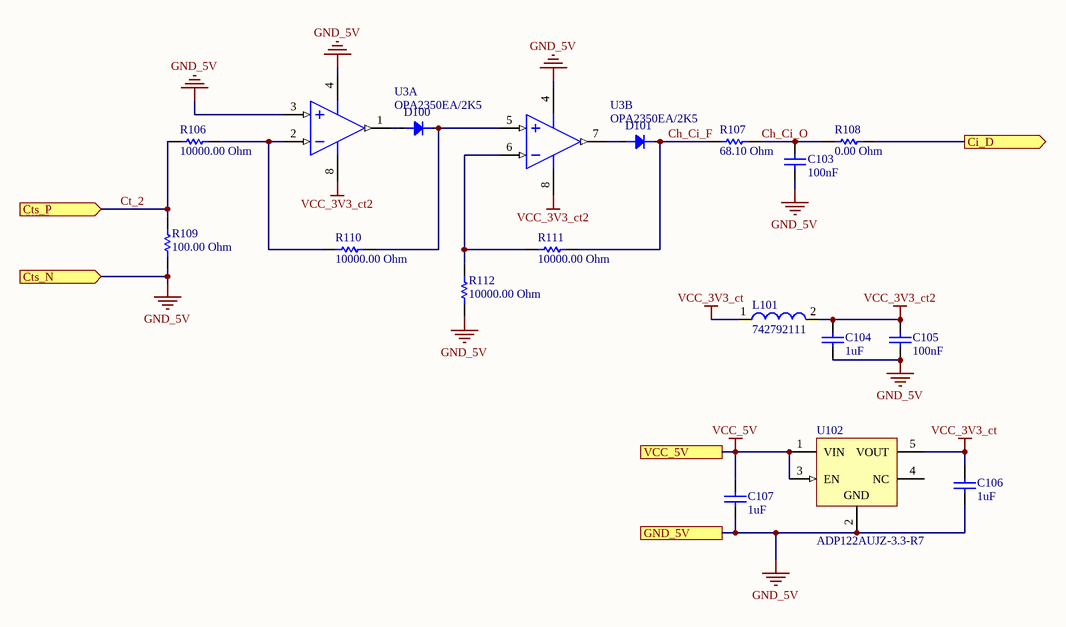
[diagram p3: current_sensor_transformer.SchDoc]

### Parts
C103  value 100nF  [CAPC0603(1608)100_L]  (hidden comment: CAP 100nF 10V 0603(1608))
C104  value 1uF  [CAPC0603(1608)100_L]  (hidden comment: CAP 1uF 50V 0603(1608))
C105  value 100nF  [CAPC0603(1608)100_L]  (hidden comment: CAP 100nF 10V 0603(1608))
C106  value 1uF  [CAPC0603(1608)100_N]  (hidden comment: CAP 1uF 50V 0603(1608))
C107  value 1uF  [CAPC0603(1608)100_N]  (hidden comment: CAP 1uF 50V 0603(1608))
D100  NRVB120VLSFT1G  [NRVB120VLSFT1G]  (value not drawn)
D101  NRVB120VLSFT1G  [NRVB120VLSFT1G]  (value not drawn)
L101  742792111  [SMD-1206]
R106  10000.00 Ohm  [RESC1609X55X30LL15T15]
R107  value 68.10 Ohm  [RESC0805(2012)_L]  (hidden comment: 68R1 1% 0805(2012))
R108  value 0.00 Ohm  [RESC0603(1608)_L]  (hidden comment: Jumper 0603(1608))
R109  100.00 Ohm  [RESC1005X40X25NL05T05]
R110  10000.00 Ohm  [RESC1609X55X30LL15T15]
R111  10000.00 Ohm  [RESC1609X55X30LL15T15]
R112  10000.00 Ohm  [RESC1609X55X30LL15T15]
U3  OPA2350EA/2K5  [DGK0008A_N]  (parts A,B of 2)
U102  ADP122AUJZ-3.3-R7  [ADI-UJ-5_L]

### Ports
Ci_D (out), Cts_N (in), Cts_P (in), GND_5V, VCC_5V

### Nets
GND_5V: C103.1 C104.1 C105.1 C106.1 C107.1 R109.1 R112.2 U3.3(IN_A+) U3.4(V-) U102.2(GND) ; port GND_5V, port Cts_N
VCC_3V3_ct: C106.2 L101.1 U102.5(VOUT)
VCC_3V3_ct2: C104.2 C105.2 L101.2 U3.8(V+)
VCC_5V: C107.2 U102.1(VIN) U102.3(EN) ; port VCC_5V
Ch_Ci_F: D101.2 R107.2 R111.2
Ch_Ci_O: C103.2 R107.1 R108.2
Ct_2: R106.2 R109.2 ; port Cts_P
V_ct_D: R108.1 ; port Ci_D
NetD100_1: D100.1 U3.1(OUT_A)
NetD100_2: D100.2 R110.1 U3.5(IN_B+)
NetD101_1: D101.1 U3.7(OUT_B)
NetR106_1: R106.1 R110.2 U3.2(IN_A-)
NetR111_1: R111.1 R112.1 U3.6(IN_B-)

Not connected (* = marked no-connect by the designer): U102 4(NC)

### Library data of the parts
C103 C105 = CMP-1035-02580-1: as C117 on sheet voltage_sensor_HiZ_OpAmp; Max Thickness: 1 mm; Rated Voltage: 10 V; Technology: SMT
C104 C106 C107 = CMP-1035-02746-1: as C119 on sheet voltage_sensor_HiZ_OpAmp; Technology: SMT; Max Thickness: 1 mm; Rated Voltage: 50 V
D100 D101 = NRVB120VLSFT1G: REEL / AUTO STANDARD OF MBR120VL; Manufacturer: ON Semiconductor; Max Reverse Voltage (DC): 20V; Element Configuration: Single; Average Rectified Current: 1A; Peak Reverse Current: 15mA; Peak Non-Repetitive Surge Current: 45A; Supplier 1: Digi-Key; Manufacturer Part Number: NRVB120VLSFT1G; Stock 1: 5674; Pricing 1: 1 = 0.43000, 10 = 0.36700, 25 = 0.34240, 100 = 0.25430, 250 = 0.24156, 500 = 0.19854, 1000 = 0.16137 (USD); RoHS: Yes; Mount: Surface Mount; Case/Package: SOD; Number of Pins: 2; Min Operating Temperature: -65°C; Max Operating Temperature: 125°C; Packaging: Tape and Reel; Max Repetitive Reverse Voltage (Vrrm): 20V; Lead Free: Lead Free; ComponentLink1URL: http://www.mouser.com/ds/2/308/MBR120VLSFT1-D-1074021.pdf?src-supplier=Mouser; ComponentLink1Description: http://www.mouser.com/ds/2/308/MBR120VLSFT1-D-1074021.pdf?src-supplier=Mouser; ComponentLink2URL: http://www.farnell.com/datasheets/2028665.pdf?src-supplier=Farnell; ComponentLink2Description: http://www.farnell.com/datasheets/2028665.pdf?src-supplier=Farnell; ComponentLink3URL: http://www.onsemi.com/pub/Collateral/MBR120VLSFT1-D.PDF?src-supplier=Avnet; ComponentLink3Description: http://www.onsemi.com/pub/Collateral/MBR120VLSFT1-D.PDF?src-supplier=Avnet; ComponentLink4URL: http://www.farnell.com/datasheets/2028665.pdf?src-supplier=Element14; ComponentLink4Description: http://www.farnell.com/datasheets/2028665.pdf?src-supplier=Element14; ComponentLink5URL: http://www.onsemi.com/pub/Collateral/MBR120VLSFT1-D.PDF?src-supplier=Digi-Key; ComponentLink5Description: http://www.onsemi.com/pub/Collateral/MBR120VLSFT1-D.PDF?src-supplier=Digi-Key; ComponentLink6URL: http://www.farnell.com/datasheets/2028665.pdf?src-supplier=Newark; ComponentLink6Description: http://www.farnell.com/datasheets/2028665.pdf?src-supplier=Newark; Supplier Part Number 1: NRVB120VLSFT1GOSCT-ND
L101 = CMP-0220-00024-1: as L103 on sheet voltage_sensor_HiZ_OpAmp; ComponentLink2Description: Datasheet; PackageReference: SMD-1206; ComponentLink2URL: http://www.we-online.de/katalog/media/pdf/742792111.pdf; PackageVersion: 2007; DatasheetVersion: Dec-2005; PackageDescription: Chip Inductor, 2-Leads, Body 3.2 x 1.6 mm; ComponentLink1URL: http://www.we-online.com; ComponentLink1Description: Manufacturer Link
R106 R110-R112 = CMP-2000-07452-1: Chip Resistor, 10 KOhm, +/- 1%, 0.1 W, -55 to 155 degC, 0603 (1608 Metric), RoHS, Tape and Reel; Manufacturer: Panasonic; Voltage Rating: 75V; Case\/Package: 0603; Power Rating: 100mW; Resistance: 10KOhm; Temperature Coefficient: 100ppm\/degreesC; Number of Pins: 2; Package Reference: 603; Depth: 0.8mm; Mount: SurfaceMount; Package Description: 2-Pin Surface Mount Device, Body 1.6 x 0.85 mm; Datasheet Version: 02/2017; Length: 1.6mm; Lead Free: LeadFree; Height: 0.45mm; Number of Terminations: 2; Max Power Dissipation: 100mW; Min Operating Temperature: -55degC; Datasheet URL: https://industrial.panasonic.com/cdbs/www-data/pdf/RDA0000/AOA0000C304.pdf; Termination: SMD/SMT; Case Code (Metric): 1608; Case Code (Imperial): 0603; Tolerance: 1%; Max Operating Temperature: 155degC; RoHSCompliant: true; Voltage Rating (DC): 75V; Radiation Hardening: No; Packaging: TapeandReel; Composition: ThickFilm; Mounting Technology: SurfaceMount; Manufacturer URL: http://www.panasonic.com/; Width: 0.031inch; REACH SVHC: NoSVHC; Contact Plating: Tin; Military Standard: Not; Package Quantity: 1
R107 = CMP-1013-00379-1: 68R1 0.125W 1% 0805 (2012 Metric)  SMD; Case-EIA: 0805; Case-Metric: 2012; Power: 0.125 W; Tolerance: 1 %; Technology: SMT
R108 = CMP-1012-00001-1: as R129 on sheet voltage_sensor_HiZ_OpAmp; Technology: SMT; Tolerance: None
R109 = CMP-2002-08127-1: Part Number: CRCW0402100RFKED; Manufacturer: Vishay Dale
U3 = OPA2350EA/2K5: High-Speed, Single-Supply, Rail-to-Rail Operational Amplifier MicroAmplifier(TM) Series, 2.7 to 5.5 V, -40 to 85 degC, 8-pin SOP (DGK8), Green (RoHS & no Sb/Br); Manufacturer: Texas Instruments; Vn at 1kHz(Typ)(nV/rtHz): 18; Iq per channel(Max)(mA): 8.5; Sub Family: Low Input Bias Current Amp (<=10pA), Low Offset Voltage Amplifier (<=500uV), Low Supply Voltage Amplifier (<=2.7V), Precision Amplifier; CMRR(Min)(dB): 74; Total Supply Voltage(Min)(+5V is 5, +/-5V is 10): 2.7; Offset Drift(Typ)(uV/C): 4; Total Supply Voltage(Max)(+5V is 5, +/-5V is 10): 5.5; Number of Channels: 2; Slew Rate(Typ)(V/us): 22; IIB(Max)(pA): 10; Vio (25C)(Max)(mV): 1; ComponentLink1Description: Manufacturer URL; ComponentLink2URL: http://www.ti.com/general/docs/lit/getliterature.tsp?genericPartNumber=OPA2350&fileType=pdf; PackageDescription: 8-Pin Thin Small Outline, Body 3 x 3 mm, Pitch 0.65 mm; ComponentLink2Description: Datasheet; PackageReference: DGK0008A; PartNumber: OPA2350EA/2K5; Mounting Technology: Surface Mount; ComponentLink3Description: Package Specification; DatasheetVersion: SBOS099C; Code_JEDEC: MO-187; Eco-Plan: Green (RoHS & no Sb/Br); ComponentLink3URL: http://www.ti.com/litv/pdf/mpds028d; ComponentLink1URL: http://www.ti.com/; PackageVersion: 4073329/E, 05/2006; Supplier 1: Digi-Key; Supplier 2: Digi-Key; Supplier 3: Digi-Key; Supplier 4: Mouser; Supplier 5: Farnell; Supplier 6: Newark; Supplier Part Number 6: 28AH4511; Supplier Part Number 5: 3004918; Supplier Part Number 4: 595-OPA2350EA/2K5; Supplier Part Number 3: 296-39117-2-ND; Supplier Part Number 2: 296-39117-6-ND; Supplier Part Number 1: 296-39117-1-ND
U102 = CMP-0786-00346-1: as U106 on sheet voltage_sensor_HiZ_OpAmp; ComponentLink4Description: URL Link1; ComponentLink4URL: Product URL:http://www.analog.com/en/ADP122/productSearch.html; ComponentLink2URL: http://www.analog.com/static/imported-files/data_sheets/ADP122_123.pdf; PackageDescription: 5-Pin Thin Small Outline Transistor Package, Body 2.9 x 1.6 mm, Pitch 0.95 mm; ComponentLink1URL: http://www.analog.com/en/index.html; ComponentLink3URL: http:/www.analog.com/static/imported-files/packages/PKG_PDF/TSOT(UJ)/UJ_5.pdf; ComponentLink2Description: Datasheet; PartNumber: ADP122AUJZ-3.3-R7; Packing: Reel; ComponentLink1Description: Manufacturer URL; Code_JEDEC: MO-193-AB; PackageVersion: 100708-A, 10/2008; PackageReference: UJ-5; Mounting Technology: Surface Mount; DatasheetVersion: Rev. E; ComponentLink3Description: Package Specification

## Sheet thermocouple.SchDoc
size A4
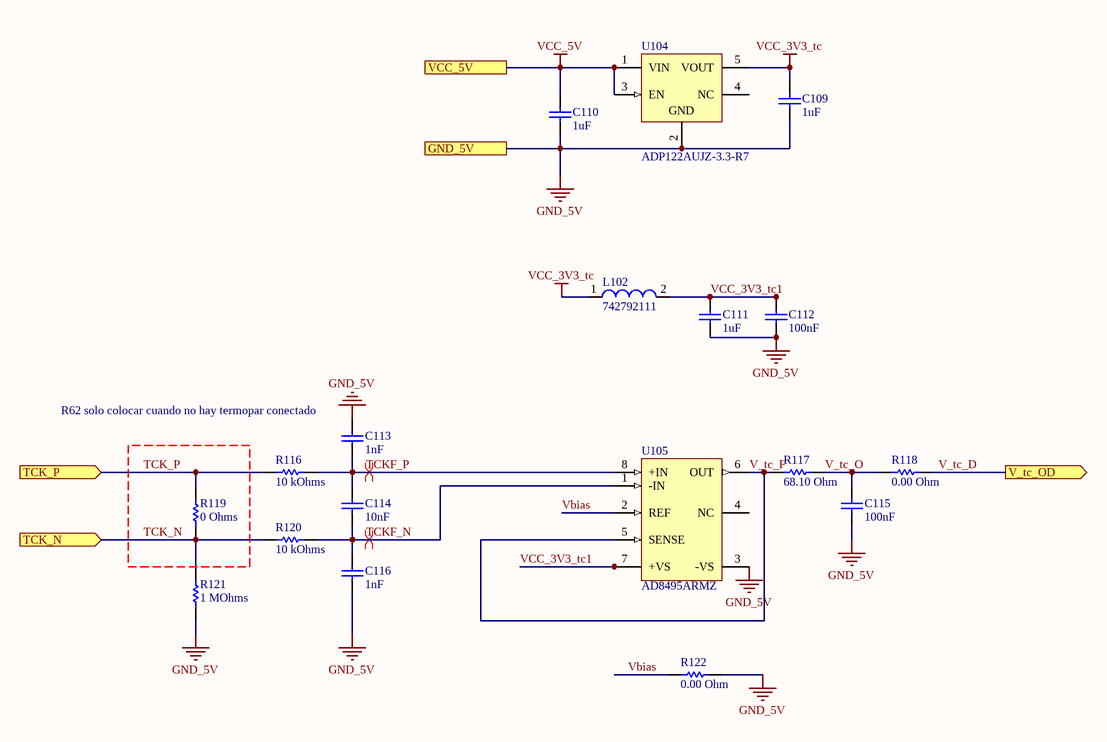
[diagram p4: thermocouple.SchDoc]

### Parts
C109  value 1uF  [CAPC0603(1608)100_N]  (hidden comment: CAP 1uF 50V 0603(1608))
C110  value 1uF  [CAPC0603(1608)100_N]  (hidden comment: CAP 1uF 50V 0603(1608))
C111  value 1uF  [CAPC0603(1608)100_L]  (hidden comment: CAP 1uF 50V 0603(1608))
C112  value 100nF  [CAPC0603(1608)100_L]  (hidden comment: CAP 100nF 50V 0603(1608))
C113  value 1nF  [CAPC0603(1608)100_L]  (hidden comment: CAP 1nF 25V 0603(1608))
C114  value 10nF  [CAPC0603(1608)100_L]  (hidden comment: CAP 10nF 25V 0603(1608))
C115  value 100nF  [CAPC0603(1608)100_N]  (hidden comment: CAP 100nF 10V 0603(1608))
C116  value 1nF  [CAPC0603(1608)100_L]  (hidden comment: CAP 1nF 25V 0603(1608))
L102  742792111  [SMD-1206]
R116  value 10 kOhms  [RESC3116X65X50NL20T20]  (hidden comment: CRCW120610K0FKEAHP)
R117  value 68.10 Ohm  [RESC0805(2012)_N]  (hidden comment: 68R1 1% 0805(2012))
R118  value 0.00 Ohm  [RESC0603(1608)_N]  (hidden comment: Jumper 0603(1608))
R119  value 0 Ohms  [RESC3216X60X45LL10T20]  (hidden comment: CRCW12060000Z0EB)
R120  value 10 kOhms  [RESC3116X65X50NL20T20]  (hidden comment: CRCW120610K0FKEAHP)
R121  value 1 MOhms  [RESC3216X70X50LL05T20]  (hidden comment: ERJ-8GEYJ105V)
R122  value 0.00 Ohm  [RESC0603(1608)_L]  (hidden comment: Jumper 0603(1608))
U104  ADP122AUJZ-3.3-R7  [ADI-UJ-5_L]
U105  AD8495ARMZ  [DGK0008A_L]

### Ports
GND_5V, TCK_N (in), TCK_P (in), V_tc_OD (out), VCC_5V

### Nets
GND_5V: C109.1 C110.1 C111.1 C112.1 C113.1 C115.1 C116.2 R121.1 R122.2 U104.2(GND) U105.3(-VS) ; port GND_5V
VCC_3V3_tc: C109.2 L102.1 U104.5(VOUT)
VCC_5V: C110.2 U104.1(VIN) U104.3(EN) ; port VCC_5V
TCK_N: R119.1 R120.2 R121.2 ; port TCK_N
TCK_P: R116.2 R119.2 ; port TCK_P
TCKF_N: C114.2 C116.1 R120.1 U105.1(-IN)
TCKF_P: C113.2 C114.1 R116.1 U105.8(+IN)
V_tc_D: R118.1 ; port V_tc_OD
V_tc_F: R117.2 U105.5(SENSE) U105.6(OUT)
V_tc_O: C115.2 R117.1 R118.2
Vbias: R122.1 U105.2(REF)
VCC_3V3_tc1: C111.2 C112.2 L102.2 U105.7(+VS)

Not connected (* = marked no-connect by the designer): U104 4(NC); U105 4(NC)

### Layout directives
differential pair: TCKF_N, TCKF_P

### Notes on the sheet
- (near C113) R62 solo colocar cuando no hay termopar conectado

### Library data of the parts
C109-C111 = CMP-1035-02746-1: as C119 on sheet voltage_sensor_HiZ_OpAmp; Technology: SMT; Max Thickness: 1 mm; Rated Voltage: 50 V
C112 = CMP-1035-02591-1: CAP 100nF 50V ±5% 0603 (1608 Metric) Thickness 1mm SMD; Tolerance: Â±5%; Case-Metric: 1608; Case-EIA: 0603; Rated Voltage: 50 V; Max Thickness: 1 mm; Technology: SMT
C113 C116 = CMP-1035-01883-1: CAP 1nF 25V ±5% 0603 (1608 Metric) Thickness 1mm SMD; Case-EIA: 0603; Tolerance: Â±5%; Case-Metric: 1608; Technology: SMT; Rated Voltage: 25 V; Max Thickness: 1 mm
C114 = CMP-1035-02316-1: CAP 10nF 25V ±5% 0603 (1608 Metric) Thickness 1mm SMD; Tolerance: Â±5%; Case-EIA: 0603; Case-Metric: 1608; Rated Voltage: 25 V; Technology: SMT; Max Thickness: 1 mm
C115 = CMP-1035-02580-1: as C117 on sheet voltage_sensor_HiZ_OpAmp; Max Thickness: 1 mm; Rated Voltage: 10 V; Technology: SMT
L102 = CMP-0220-00024-1: as L103 on sheet voltage_sensor_HiZ_OpAmp; ComponentLink2Description: Datasheet; PackageReference: SMD-1206; ComponentLink2URL: http://www.we-online.de/katalog/media/pdf/742792111.pdf; PackageVersion: 2007; DatasheetVersion: Dec-2005; PackageDescription: Chip Inductor, 2-Leads, Body 3.2 x 1.6 mm; ComponentLink1URL: http://www.we-online.com; ComponentLink1Description: Manufacturer Link
R116 R120 = CMP-2003-04883-1: Manufacturer: Vishay Dale; Precision: 1%; Part Number: CRCW120610K0FKEAHP; Package: 1206
R117 = CMP-1013-00379-1: as R107 on sheet current_sensor_transformer; Power: 0.125 W; Tolerance: 1 %; Technology: SMT
R118 R122 = CMP-1012-00001-1: as R129 on sheet voltage_sensor_HiZ_OpAmp; Technology: SMT; Tolerance: None
R119 = CMP-2003-04797-1: Manufacturer: Vishay Dale; Part Number: CRCW12060000Z0EB; Package: 1206
R121 = CMP-2003-00547-1: Manufacturer: Panasonic; Precision: 5%; Part Number: ERJ-8GEYJ105V; Package: 1206
U104 = CMP-0786-00346-1: as U106 on sheet voltage_sensor_HiZ_OpAmp; ComponentLink4Description: URL Link1; ComponentLink4URL: Product URL:http://www.analog.com/en/ADP122/productSearch.html; ComponentLink2URL: http://www.analog.com/static/imported-files/data_sheets/ADP122_123.pdf; PackageDescription: 5-Pin Thin Small Outline Transistor Package, Body 2.9 x 1.6 mm, Pitch 0.95 mm; ComponentLink1URL: http://www.analog.com/en/index.html; ComponentLink3URL: http:/www.analog.com/static/imported-files/packages/PKG_PDF/TSOT(UJ)/UJ_5.pdf; ComponentLink2Description: Datasheet; PartNumber: ADP122AUJZ-3.3-R7; Packing: Reel; ComponentLink1Description: Manufacturer URL; Code_JEDEC: MO-193-AB; PackageVersion: 100708-A, 10/2008; PackageReference: UJ-5; Mounting Technology: Surface Mount; DatasheetVersion: Rev. E; ComponentLink3Description: Package Specification
U105 = AD8495ARMZ: Full K-Type Thermocouple Amplifier with Cold Junction Compensation, Industrial, 8-pin SOP (RM-8), Tube; Manufacturer: Analog Devices; ComponentLink3URL: http://www.analog.com/static/imported-files/packages/PKG_PDF/MSOP%28RM%29/RM_8.pdf; ComponentLink4URL: http://www.analog.com/en/mems-sensors/digital-temperature-sensors/ad8495/products/product.html; ComponentLink1URL: http://www.analog.com/en/index.html; PartNumber: AD8495ARMZ; PackageVersion: 08/2005; PackageReference: RM-8; PackageDescription: 8-Pin Mini Small Outline Package, Body 3 x 3 mm, Pitch 0.65 mm; ComponentLink1Description: Manufacturer URL; Code_JEDEC: MO-187-AA; ComponentLink2URL: http://www.analog.com/static/imported-files/data_sheets/AD8494_8495_8496_8497.pdf; Mounting Technology: Surface Mount; ComponentLink4Description: Product URL; ComponentLink3Description: Package Specification; Packing: Tube; ComponentLink2Description: Datasheet; DatasheetVersion: Rev. C; Supplier 1: Digi-Key; Supplier 2: Arrow; Supplier 3: Mouser; Supplier 4: Farnell; Supplier Part Number 1: AD8495ARMZ-ND; Supplier Part Number 2: AD8495ARMZ; Supplier Part Number 3: 584-AD8495ARMZ; Supplier Part Number 4: 1864707

## Sheet sstate_relay_discharge.SchDoc
size A4
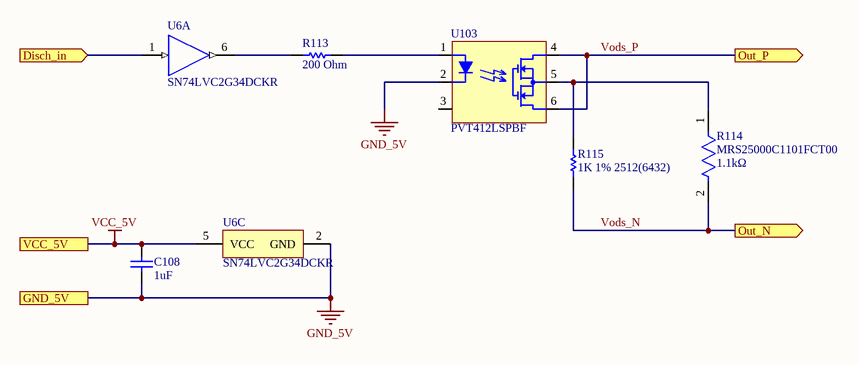
[diagram p5: sstate_relay_discharge.SchDoc]

### Parts
C108  value 1uF  [CAPC0603(1608)100_N]  (hidden comment: CAP 1uF 50V 0603(1608))
R113  value 200 Ohm  [RESC2013X60X40NL20T25]  (hidden comment: ERA6AEB201V)
R114  MRS25000C1101FCT00  value 1.1kΩ  [FP-MRS25-MFG]
R115  1K 1% 2512(6432)  [RESC2512(6432)_M]
U6  SN74LVC2G34DCKR  [DCK0006A_L]  (parts A,C of 3)
U103  PVT412LSPBF  [SOP254P980X318-6M-PVT412LSPBF]

### Ports
Disch_in (in), GND_5V, Out_N (out), Out_P (out), VCC_5V

### Nets
GND_5V: C108.1 U6.2(GND) U103.2 ; port GND_5V
VCC_5V: C108.2 U6.5(VCC) ; port VCC_5V
Vods_N: R114.2 R115.1 ; port Out_N  [project net V_o_N]
Vods_P: U103.4 U103.6 ; port Out_P  [project net V_o_P]
X_dsc_I: U6.1(1A) ; port Disch_in
NetR113_1: R113.1 U6.6(1Y)
NetR113_2: R113.2 U103.1
NetR114_1: R114.1 R115.2 U103.5

Not connected (* = marked no-connect by the designer): U103 3

### Library data of the parts
C108 = CMP-1035-02746-1: as C119 on sheet voltage_sensor_HiZ_OpAmp; Technology: SMT; Max Thickness: 1 mm; Rated Voltage: 50 V
R113 = CMP-2001-00608-1: Manufacturer: Panasonic; Part Number: ERA6AEB201V; Package: 0805
R114 = CMP-02408-000003-1: RES 1.1K OHM 0.6W 1% AXIAL; Manufacturer: Vishay BC Components; Voltage Rating: 350V; Temperature Coefficient: 50ppm/°C; Device Class L1: Passive Components; Height: 2.5mm; Octopart: https://octopart.com/mrs25000c1101fct00-vishay-43740214; Temperature Range Low: -55°C; Temperature: -55°C to +155°C; Temperature Range High: +155°C; Lead Free: Yes; Mouser Description: Thin Film Resistors .6watt 1.1Kohms 1%; Power Rating: 0.6W; Digikey Description: RES 1.1K OHM 0.6W 1% AXIAL; RoHS: TRUE; Tolerance: 1%; Package: MRS25; Device Class L3: Through-Hole Resistors; ComponentLink2URL: http://www.vishay.com/docs/28724/mrs16m25.pdf; ComponentLink2Description: Datasheet; Resistance: 1.1kΩ; Composition: Thin Film; Automotive: No; Ipc Land Pattern Name: RESAD1000W75L650D250; Device Class L2: Resistors; Category: Res; Series: MRS25; Manufacturer Part Number: MRS25000C1101FCT00
R115 = CMP-1018-00510-1: 1K 1W 1% 2512 (6432 Metric)  SMD; Case-EIA: 2512; Case-Metric: 6432; Value: 1000.00 Ohm; Technology: SMT; Tolerance: 1 %; Power: 1 W
U6 = CMP-0859-00474-3: Dual Buffer Gate, DCK0006A, LARGE T&R; Manufacturer: Texas Instruments; Voltage(Nom)(V): 1.8,2.5,3.3,5; Schmitt Trigger: No; Rating: Catalog; Output Type: CMOS; F @ Nom Voltage(Max)(Mhz): 150; Output Drive (IOL/IOH)(Max)(mA): 32/-32; Sub-Family: Non-Inverting Buffer/Driver; Technology Family: LVC; Input Type: CMOS/TTL; ICC @ Nom Voltage(Max)(mA): 0.01; VCC(Min)(V): 1.65; Bits(#): 2; Logic: True; tpd @ Nom Voltage(Max)(ns): 8.6,4.4,4.1,3.2; VCC(Max)(V): 5.5; 3-State Output: No; Operating Temperature Range(C): -40 to 125,-40 to 85; DatasheetVersion: SCES359I; PackageReference: DCK0006A; Generic Part Number: SN74LVC2G34
U103 = PVT412LSPBF: IC RELAY PHOTOVO 400V 120MA 6SMD; Manufacturer: International Rectifier; Max Input Current: 25mA; Throw Configuration: SPST,SP; Isolation Voltage: 4kV; On-State Resistance: 35R; Turn-On Delay Time: 2ms; Approvals: UL; Manufacturer Part Number: PVT412LSPBF; RoHS: Yes; Category: Solid State Relays; Stock 1: 335; Pricing 1: 1=3,23000, 10=3,03100, 25=2,69480, 50=2,55980, 100=2,42510, 250=2,15568, 500=2,02096, 1000=1,88622, 5000=1,81886 (USD); Mount: Surface Mount; Case/Package: SMD/SMT; Number of Pins: 6; Min Operating Temperature: -40°C; Max Operating Temperature: 85°C; Max Output Voltage: 400V; Packaging: Rail/Tube; Input Current: 25mA; Load Current: 120mA; Termination: Gull Wing; Output Current: 120mA; Package Quantity: 50; Relay Type: Relay; Output Voltage: 400V; Length: 8.63mm; Height: 3.42mm; Depth: 6.47mm; Radiation Hardening: No; Lead Free: Lead Free; ComponentLink1URL: https://datasheet.ciiva.com/15141/getdatasheetpartid-385077-15141601.pdf?src-supplier=Verical; ComponentLink1Description: https://datasheet.ciiva.com/15141/getdatasheetpartid-385077-15141601.pdf?src-supplier=Verical; ComponentLink2URL: https://datasheet.ciiva.com/26924/pvt412lspbf-26924616.pdf?src-supplier=IIIC; ComponentLink2Description: https://datasheet.ciiva.com/26924/pvt412lspbf-26924616.pdf?src-supplier=IIIC; ComponentLink3URL: https://datasheet.ciiva.com/17305/pvt412-17305893.pdf?src-supplier=Avnet+Europe; ComponentLink3Description: https://datasheet.ciiva.com/17305/pvt412-17305893.pdf?src-supplier=Avnet+Europe; ComponentLink4URL: https://datasheet.ciiva.com/2421/pvt412-2421789.pdf?src-supplier=Digi-Key; ComponentLink4Description: https://datasheet.ciiva.com/2421/pvt412-2421789.pdf?src-supplier=Digi-Key; Supplier 1: Digi-Key; Supplier 2: Arrow; Supplier 3: Avnet; Supplier 4: Mouser; Supplier 5: Farnell; Supplier Part Number 5: 2762281; Supplier Part Number 4: 942-PVT412LSPBF; Supplier Part Number 3: PVT412LSPBF; Supplier Part Number 2: PVT412LSPBF; Supplier Part Number 1: PVT412LSPBF-ND

## Nets that join several sheets
GND_5V: SUBBOARD-sensors (24 pins), voltage_sensor_HiZ_OpAmp (13 pins), current_sensor_hall (7 pins), current_sensor_transformer (10 pins), thermocouple (11 pins), sstate_relay_discharge (C108.1 U6.2 U103.2)
VCC_5V: SUBBOARD-sensors (10 pins), voltage_sensor_HiZ_OpAmp (6 pins), current_sensor_hall (C101.2 U100.1 U100.3), current_sensor_transformer (C107.2 U102.1 U102.3), thermocouple (C110.2 U104.1 U104.3), sstate_relay_discharge (C108.2 U6.5)
Ct_2: SUBBOARD-sensors (P106.1), current_sensor_transformer (R106.2 R109.2)
I_csh_in: SUBBOARD-sensors (6 pins), current_sensor_hall (U101.1 U101.2 U101.3 U101.4)
TCK_N: SUBBOARD-sensors (J100.4), thermocouple (R119.1 R120.2 R121.2)
TCK_P: SUBBOARD-sensors (J100.3), thermocouple (R116.2 R119.2)
V_csh_D: SUBBOARD-sensors (P110.3), current_sensor_hall (U101.12)
V_ct_D: SUBBOARD-sensors (P110.7), current_sensor_transformer (R108.1)
V_dc_M: SUBBOARD-sensors (P101.1), voltage_sensor_HiZ_OpAmp (R142.2 R148.2)
V_dc_N: SUBBOARD-sensors (P102.1), voltage_sensor_HiZ_OpAmp (R136.2)
V_dc_P: SUBBOARD-sensors (P100.1), voltage_sensor_HiZ_OpAmp (R154.2)
V_dcMN_D: SUBBOARD-sensors (P110.35), voltage_sensor_HiZ_OpAmp (R141.1)
V_dcPM_D: SUBBOARD-sensors (P110.37), voltage_sensor_HiZ_OpAmp (R153.1)
V_o_D: SUBBOARD-sensors (P110.33), voltage_sensor_HiZ_OpAmp (R129.1)
V_o_N: SUBBOARD-sensors (6 pins), voltage_sensor_HiZ_OpAmp (R124.2), current_sensor_hall (U101.5 U101.6 U101.7 U101.8), sstate_relay_discharge (R114.2 R115.1)
V_o_P: SUBBOARD-sensors (P103.1), voltage_sensor_HiZ_OpAmp (R130.2), sstate_relay_discharge (U103.4 U103.6)
V_tc_D: SUBBOARD-sensors (P110.31), thermocouple (R118.1)
V_x_D: SUBBOARD-sensors (P110.39), voltage_sensor_HiZ_OpAmp (R165.1)
V_x_N: SUBBOARD-sensors (P105.1), voltage_sensor_HiZ_OpAmp (R160.2)
V_x_P: SUBBOARD-sensors (P104.1), voltage_sensor_HiZ_OpAmp (R166.2)
X_csh_FOC_O: SUBBOARD-sensors (P110.5), current_sensor_hall (R104.2 U101.9)
X_csh_OC_I: SUBBOARD-sensors (P110.1), current_sensor_hall (R105.1)
X_dsc_I: SUBBOARD-sensors (P110.29), sstate_relay_discharge (U6.1)